# Altium project REINDEER_01.PrjPcb
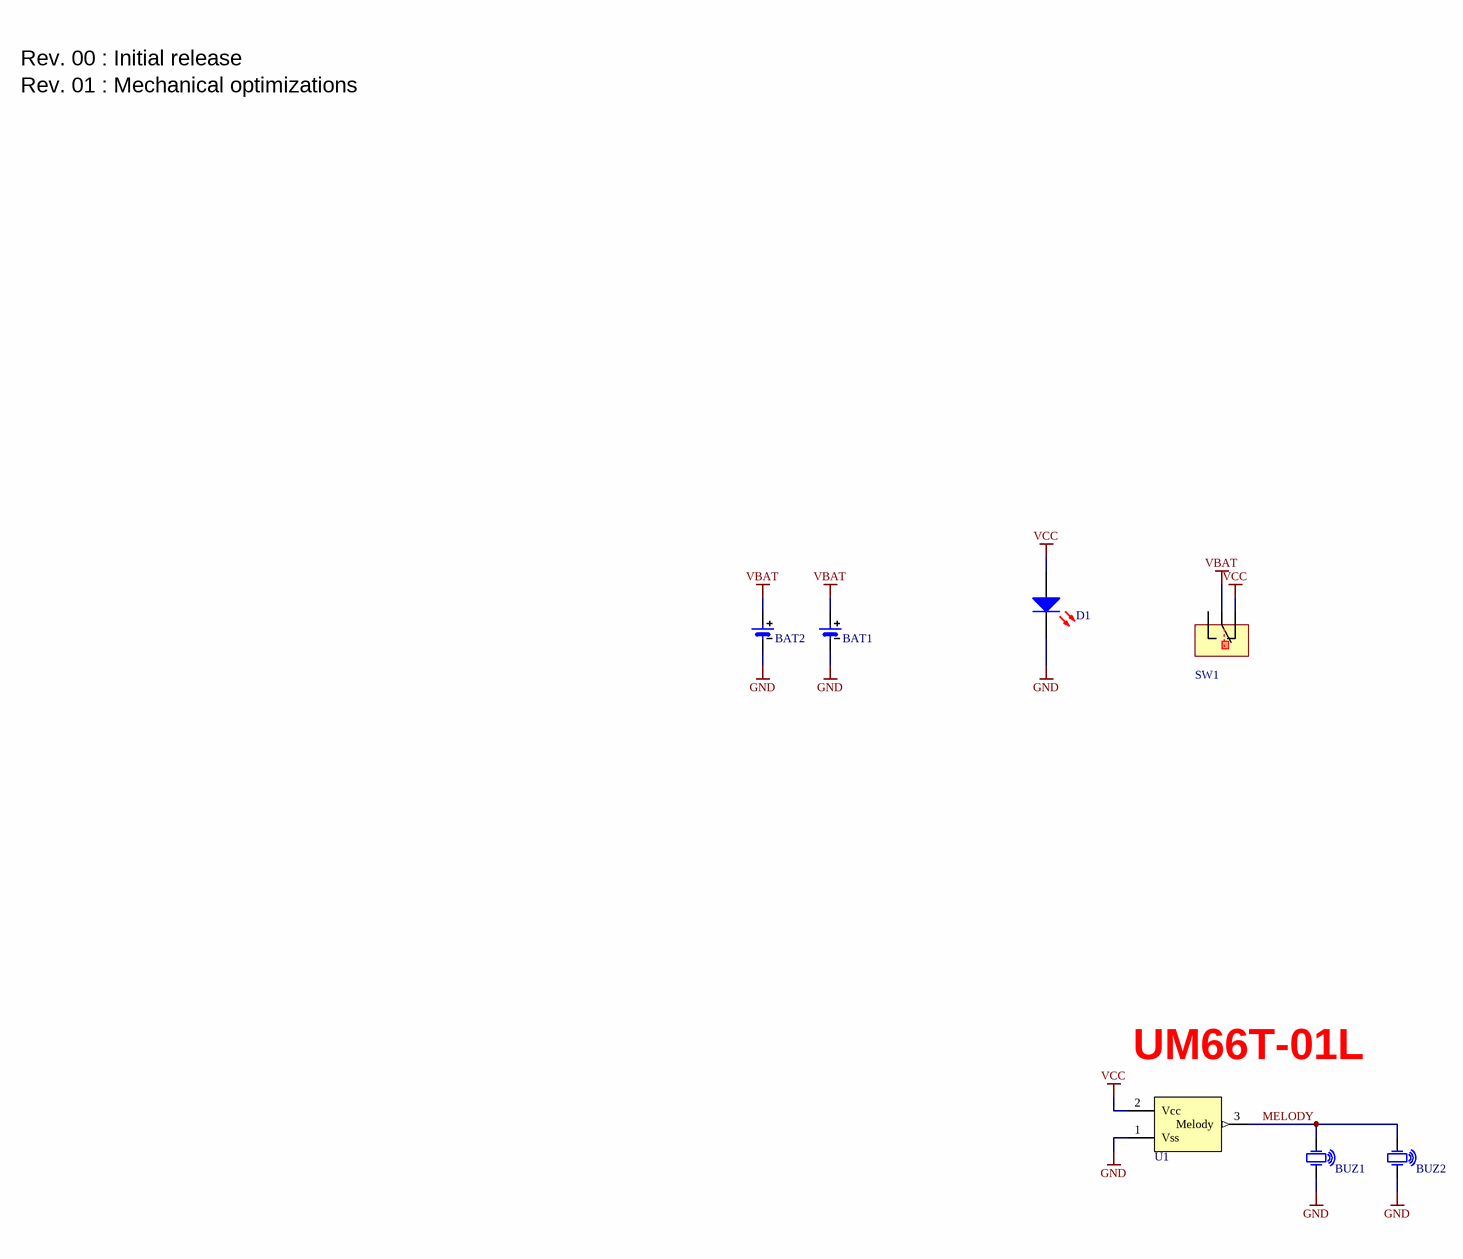
[diagram p0: REINDEER_01.SchDoc]
PCB_ENGINEER: WimVG; PCB_REV: 01; PCB_TITLE: Reindeer
1 sheet, 7 parts. Net scope: global (net labels, ports and power ports of the same name join across sheets).
Board file: REINDEER_01.PcbDoc

## Sheet REINDEER_01.SchDoc: Reindeer
size A3; Date: 08/08/2025; DrawnBy: Wim Van Gool; DocumentNumber: 1; Revision: 01; SheetNumber: 1; SheetTotal: 1

### Parts
BAT1  CR2032 SMD Battery Holder  [BAT_CR2032_KEY_1060]  (value not drawn)
BAT2  CR2032 Battery Holder  [BAT_CR2032_China]  (value not drawn)
BUZ1  12x12x3mm Piezo Buzzer Transducer 81dB  [CUI_CMT-1203-SMT]  (value not drawn)
BUZ2  14x14x7mm Piezo Buzzer Transducer 80dB  [CUI_CEP-1162]  (value not drawn)
D1  5mm IR LED, 940nm, 100mA, 1.35V, 25Deg  [LED_5MM_RD]  (value not drawn)
SW1  mini Switch 1 pole double throw right angle  [SK-12D07]  (value not drawn)
U1  UM66T - Fur Elise  [TO-92A_WIDE]  (value not drawn)

### Nets
GND: BAT1.2 BAT2.2 BUZ1.2(OSC2) BUZ2.2(OSC2) D1.2(K) U1.1(Vss)
VBAT: BAT1.1 BAT2.1 SW1.2
VCC: D1.1(A) SW1.1 U1.2(Vcc)
MELODY: BUZ1.1(OSC1) BUZ2.1(OSC1) U1.3(Melody)

Not connected (* = marked no-connect by the designer): SW1 3

### Notes on the sheet
- Rev. 00 : Initial release
- Rev. 01 : Mechanical optimizations
- (near U1) UM66T-01L
- Title
- Revision
- Date
- Dranw By
- Size
- A3
- Sheet
- of

### Library data of the parts
BAT1 = BAT # 20mm Coin Cell Holder Keystone 1060: =Description; Value: CR2032; Supplier 1: Digi-key; Supplier Part Number 1: 36-1060-ND; Supplier 2: LCSC; Supplier Part Number 2: C70377
BAT2 = BAT 20mm Coin Cell Holder Generic: =Description; Value: CR2032; Supplier 1: LCSC; Supplier Part Number 1: C5239862; Supplier 2: LCSC; Supplier Part Number 2: C70376
BUZ1 = BUZ # CUI CMT-1203-SMT: Crystal Oscillator; Value: CMT-1203-SMT; Supplier 1: Digi-key; Supplier Part Number 1: 102-2197-1-ND; Supplier 2: LCSC; Supplier Part Number 2: C409829; Supplier 3: LCSC; Supplier Part Number 3: C391037
BUZ2 = BUZ CUI CEP-1162: Crystal Oscillator; Value: CMT-1203-SMT; Supplier 1: Digi-key; Supplier Part Number 1: 102-1134-ND; Supplier 2: LCSC; Supplier Part Number 2: C360604
D1 = LED IR 5mm TSAL6400: =Description; Value: TSAL6400; Supplier 1: Farnell; Supplier Part Number 1: 3152868
SW1 = SW 1P2T micro RA SK-12D07: Description: SW 1P2T micro RA SK-12D07; Value: SK-12D07; Supplier 1: LCSC; Supplier Part Number 1: C22383479; Supplier 2: LCSC; Supplier Part Number 2: C521448
U1 = SOUND UM66T-19L: =Description; Value: UM66T-19L; Supplier 1: LCSC; Supplier Part Number 1: C136140

## Assembly variants
Default: not fitted BAT2 BUZ1 BUZ2 U1
Alternative: not fitted BAT1 BUZ1